# Altium schematic sheet 1 top level sheet.SchDoc
size A3; Organization: Altium Limited; Address1: L3, 12a Rodborough Rd; Address2: Frenchs Forest; Address3: NSW; Address4: Australia 2086; DocumentNumber: 1; SheetNumber: 1; SheetTotal: 5
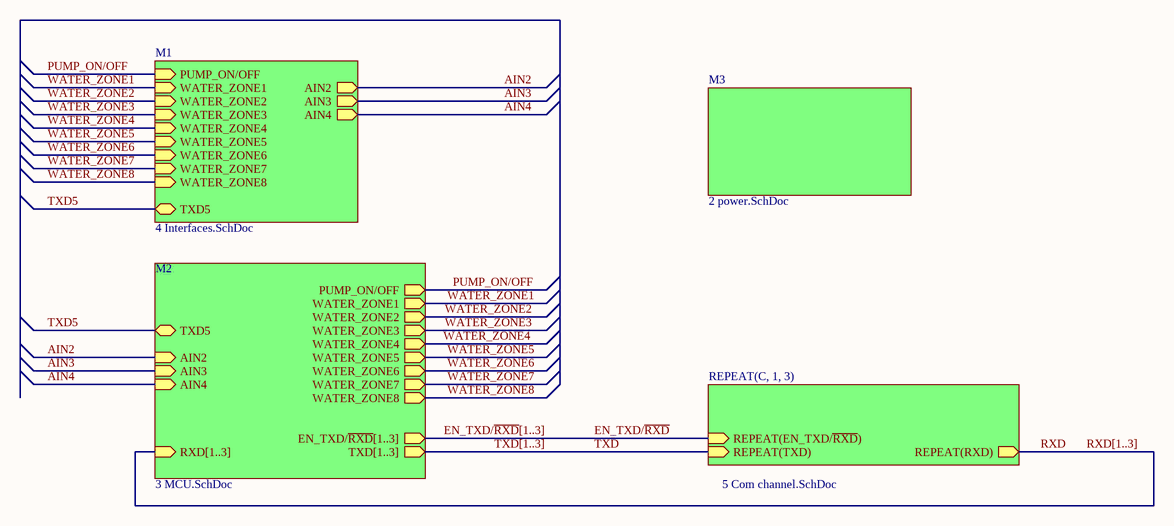
[diagram p0: 1 top level sheet.SchDoc]

## Sub-sheets
M1 = 4 Interfaces.SchDoc: WATER_ZONE3 (in), WATER_ZONE1 (in), WATER_ZONE2 (in), AIN3 (out), WATER_ZONE5 (in), AIN2 (out), WATER_ZONE8 (in), WATER_ZONE7 (in), AIN4 (out), WATER_ZONE6 (in), PUMP_ON/OFF (in), WATER_ZONE4 (in), TXD5 (bidir)
M2 = 3 MCU.SchDoc: PUMP_ON/OFF (out), WATER_ZONE1 (out), WATER_ZONE2 (out), WATER_ZONE3 (out), WATER_ZONE4 (out), WATER_ZONE5 (out), RXD[1..3] (in), TXD[1..3] (out), EN_TXD/~{RXD}[1..3] (out), WATER_ZONE8 (out), WATER_ZONE6 (out), WATER_ZONE7 (out), AIN3 (in), AIN2 (in), TXD5 (bidir), AIN4 (in)
M3 = 2 power.SchDoc: no entries
REPEAT(C, 1, 3) = 5 Com channel.SchDoc: REPEAT(RXD) (out), REPEAT(TXD) (in), REPEAT(EN_TXD/~{RXD}) (in)

## Nets
AIN2: sheet M1/AIN2, sheet M2/AIN2
AIN3: sheet M1/AIN3, sheet M2/AIN3
AIN4: sheet M1/AIN4, sheet M2/AIN4
EN_TXD/~{RXD}: sheet REPEAT(C, 1, 3)/REPEAT(EN_TXD/~{RXD})
PUMP_ON/OFF: sheet M1/PUMP_ON/OFF, sheet M2/PUMP_ON/OFF
RXD: sheet REPEAT(C, 1, 3)/REPEAT(RXD)
TXD: sheet REPEAT(C, 1, 3)/REPEAT(TXD)
TXD5: sheet M1/TXD5, sheet M2/TXD5
WATER_ZONE1: sheet M1/WATER_ZONE1, sheet M2/WATER_ZONE1
WATER_ZONE2: sheet M1/WATER_ZONE2, sheet M2/WATER_ZONE2
WATER_ZONE3: sheet M1/WATER_ZONE3, sheet M2/WATER_ZONE3
WATER_ZONE4: sheet M1/WATER_ZONE4, sheet M2/WATER_ZONE4
WATER_ZONE5: sheet M1/WATER_ZONE5, sheet M2/WATER_ZONE5
WATER_ZONE6: sheet M1/WATER_ZONE6, sheet M2/WATER_ZONE6
WATER_ZONE7: sheet M1/WATER_ZONE7, sheet M2/WATER_ZONE7
WATER_ZONE8: sheet M1/WATER_ZONE8, sheet M2/WATER_ZONE8

## Buses and harness runs
bus EN_TXD/~{RXD}[1..3] = sheet M2/EN_TXD/~{RXD}[1..3]
bus RXD[1..3] = sheet M2/RXD[1..3]
bus TXD[1..3] = sheet M2/TXD[1..3]

## Notes on the sheet
- Title
- Size:
- Date:
- A3
- Number:
- Time:
- Revision:
- Sheet
- of
- File: